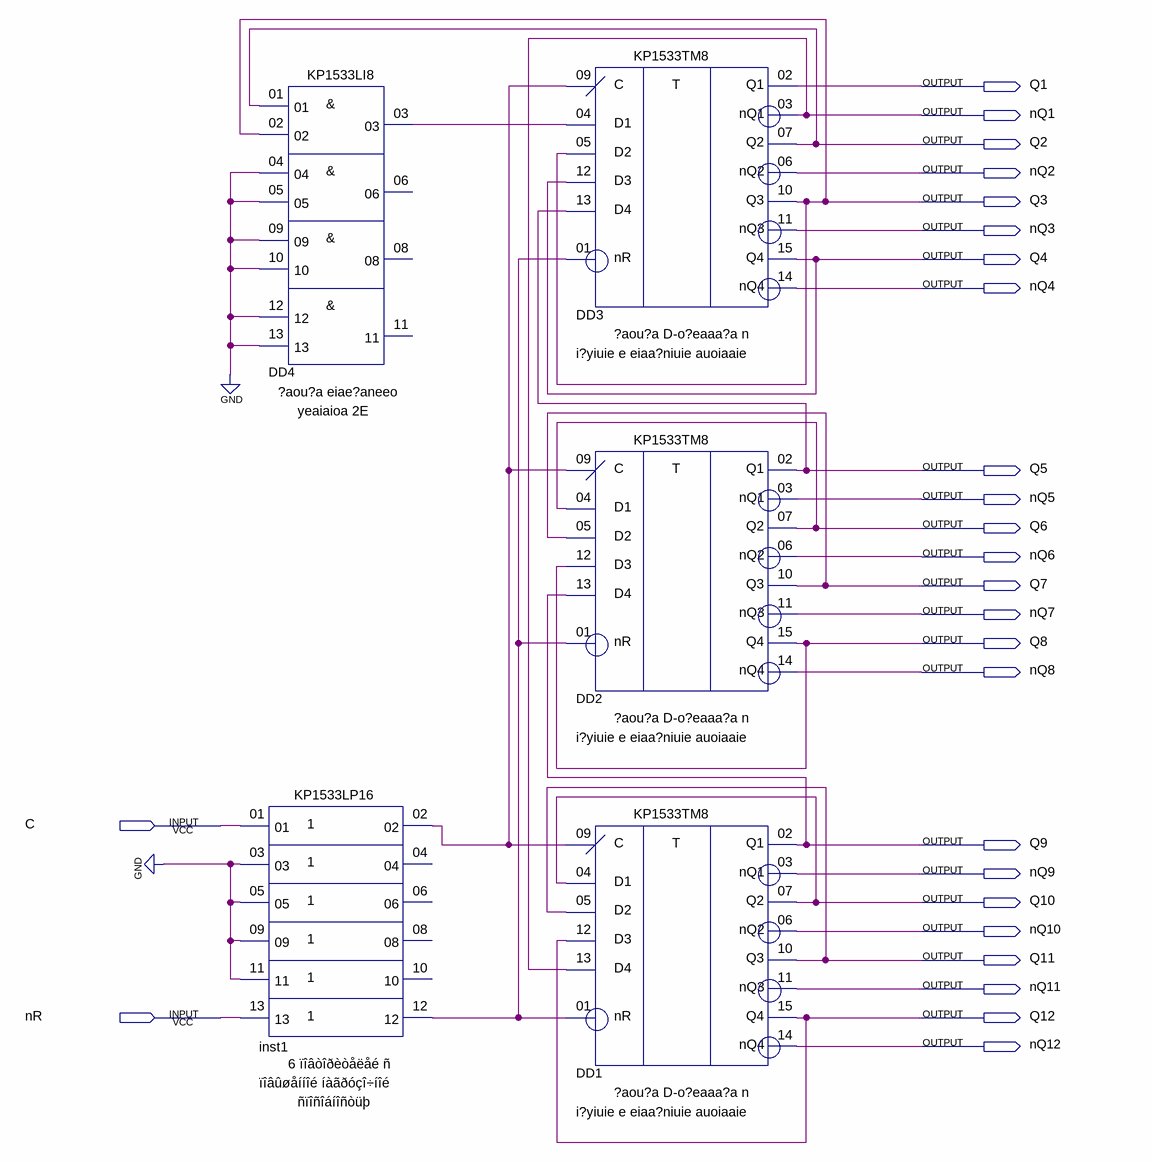
[diagram p0: schematic sheet]
// Quartus schematic _JohnsonCounterDFF.bdf as structural Verilog: 5 symbols, 26 pins
module _JohnsonCounterDFF (
  input  C,
  input  nR,
  output Q1,
  output nQ1,
  output Q2,
  output nQ2,
  output Q3,
  output nQ3,
  output Q4,
  output nQ4,
  output Q5,
  output nQ5,
  output Q6,
  output nQ6,
  output Q7,
  output nQ7,
  output Q8,
  output nQ8,
  output Q9,
  output nQ9,
  output Q10,
  output nQ10,
  output Q11,
  output nQ11,
  output Q12,
  output nQ12
);

  wire DD4_03, inst1_02, inst1_12;

  KP1533LI8 DD4 (
    .\01 (Q2), .\02 (Q3), .\04 (1'b0), .\05 (1'b0), .\09 (1'b0), .\10 (1'b0), .\12 (1'b0), .\13 (1'b0),
    .\03 (DD4_03));  // open: 06, 08, 11
  KP1533LP16 inst1 (
    .\01 (C), .\03 (1'b0), .\05 (1'b0), .\09 (1'b0), .\11 (1'b0), .\13 (nR), .\02 (inst1_02), .\12 (inst1_12));  // open: 04, 06, 08, 10
  KP1533TM8 DD3 (
    .nR(inst1_12), .C(inst1_02), .D1(DD4_03), .D2(Q3), .D3(Q4), .D4(Q5), .Q1(Q1), .nQ1(nQ1), .Q2(Q2),
    .nQ2(nQ2), .Q3(Q3), .nQ3(nQ3), .Q4(Q4), .nQ4(nQ4));
  KP1533TM8 DD2 (
    .nR(inst1_12), .C(inst1_02), .D1(Q6), .D2(Q7), .D3(Q8), .D4(Q9), .Q1(Q5), .nQ1(nQ5), .Q2(Q6), .nQ2(nQ6),
    .Q3(Q7), .nQ3(nQ7), .Q4(Q8), .nQ4(nQ8));
  KP1533TM8 DD1 (
    .nR(inst1_12), .C(inst1_02), .D1(Q10), .D2(Q11), .D3(Q12), .D4(nQ1), .Q1(Q9), .nQ1(nQ9), .Q2(Q10),
    .nQ2(nQ10), .Q3(Q11), .nQ3(nQ11), .Q4(Q12), .nQ4(nQ12));
endmodule
